# Altium schematic sheet [13] PWR1.SchDoc: Power supply
size A4; Engineer: M. Folejewski; DocumentNumber: 13; SheetNumber: 13; SheetTotal: 15; PageSize: A4; Designators: 900-949
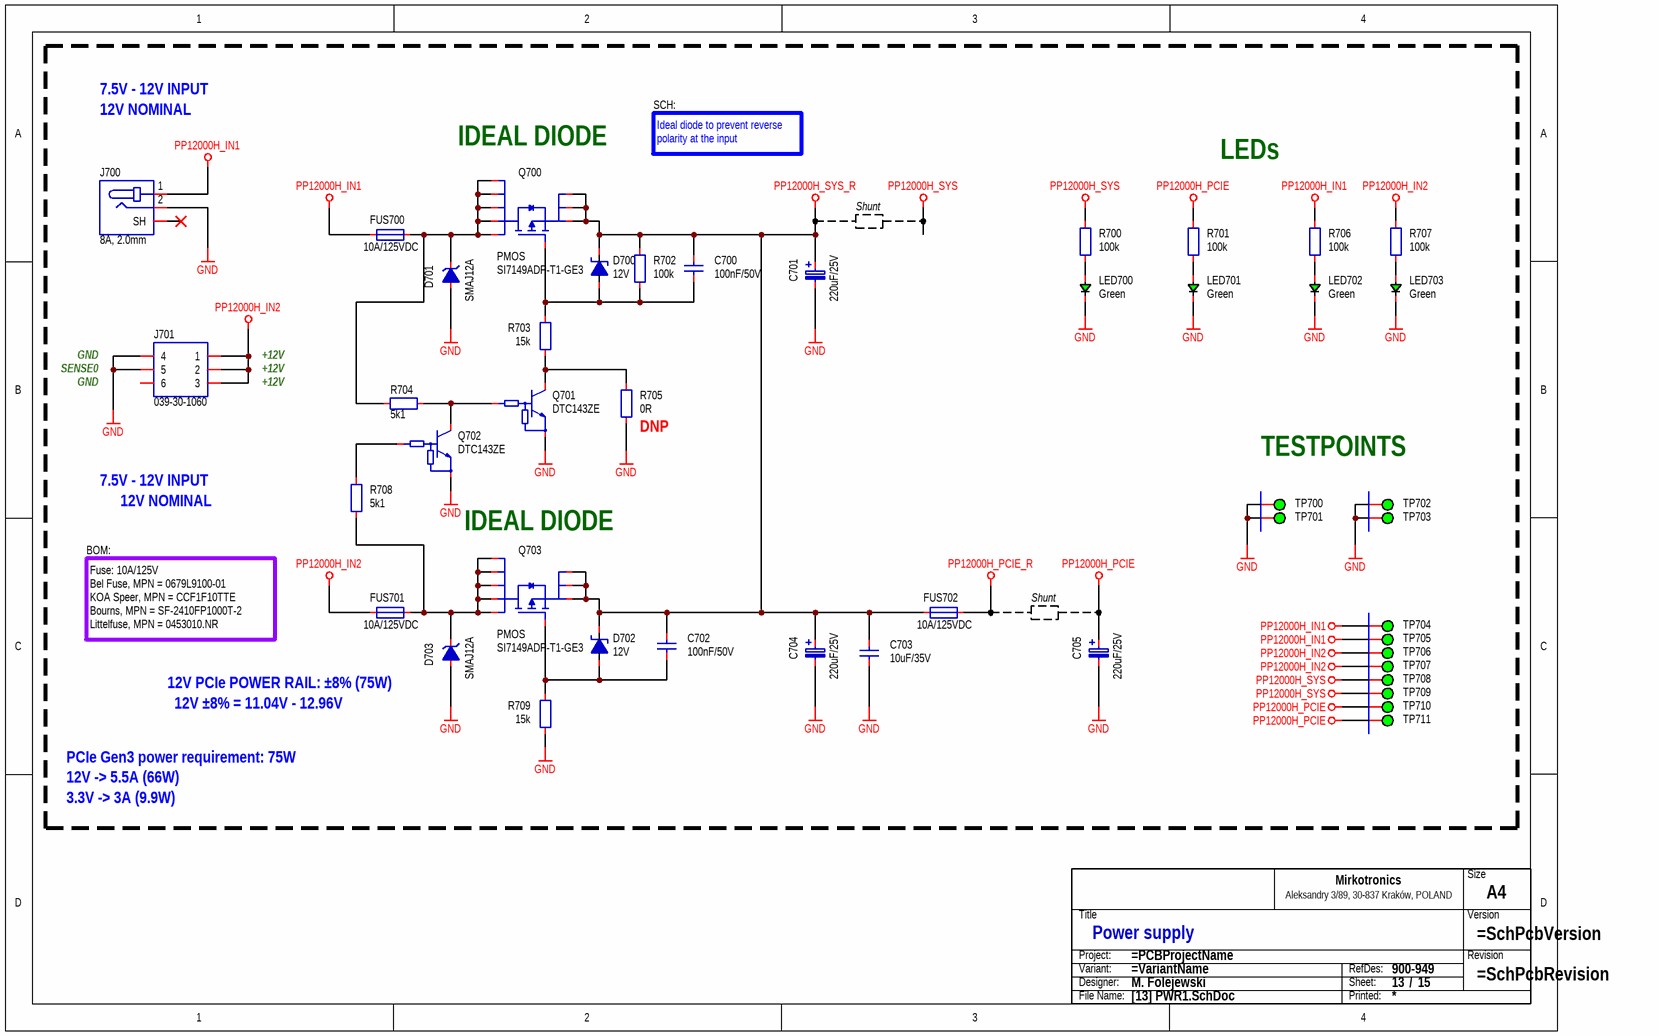
[diagram p0: [13] PWR1.SchDoc]

## Parts
C700  100nF/50V  [CAP_0603_R]
C701  220uF/25V  [CAP_SMD_SIZE_D8]
C702  100nF/50V  [CAP_0603_R]
C703  10uF/35V  [CAP_1206_R]
C704  220uF/25V  [CAP_SMD_SIZE_D8]
C705  220uF/25V  [CAP_SMD_SIZE_D8]
D700  12V  [PKG_SOT23-3_TO236]
D701  SMAJ12A  [DIO_SMA_UNI_R]
D702  12V  [PKG_SOT23-3_TO236]
D703  SMAJ12A  [DIO_SMA_UNI_R]
FUS700  10A/125VDC  [FUS_2410_R]
FUS701  10A/125VDC  [FUS_2410_R]
FUS702  10A/125VDC  [FUS_2410_R]
J700  8A, 2.0mm  [CON_CUI_PJ-063AH]
J701  039-30-1060  [CON_MLX_039301060]
LED700  Green  [LED_0805_GRN_R]
LED701  Green  [LED_0805_GRN_R]
LED702  Green  [LED_0805_GRN_R]
LED703  Green  [LED_0805_GRN_R]
Q700  PMOS  MPN: SI7149ADP-T1-GE3  [ICC_SO8_POWERPAK_490X590X112_P127_R]
Q701  DTC143ZE  [PKG_SOT523_SC75_SOT416_P100_R]
Q702  DTC143ZE  [PKG_SOT523_SC75_SOT416_P100_R]
Q703  PMOS  MPN: SI7149ADP-T1-GE3  [ICC_SO8_POWERPAK_490X590X112_P127_R]
R700  100k  [RES_0603_R]
R701  100k  [RES_0603_R]
R702  100k  [RES_0603_R]
R703  15k  [RES_0603_R]
R704  5k1  [RES_0603_R]
R705  0R  [RES_0603_R]
R706  100k  [RES_0603_R]
R707  100k  [RES_0603_R]
R708  5k1  [RES_0603_R]
R709  15k  [RES_0603_R]
TB?  Title block  (value not drawn)  (graphical)
TP700  ICT  [PCB_TP_ICT_100]  (value not drawn)  (no BOM)
TP701  ICT  [PCB_TP_ICT_100]  (value not drawn)  (no BOM)
TP702  ICT  [PCB_TP_ICT_100]  (value not drawn)  (no BOM)
TP703  ICT  [PCB_TP_ICT_100]  (value not drawn)  (no BOM)
TP704  ICT  [PCB_TP_ICT_100]  (value not drawn)  (no BOM)
TP705  ICT  [PCB_TP_ICT_100]  (value not drawn)  (no BOM)
TP706  ICT  [PCB_TP_ICT_100]  (value not drawn)  (no BOM)
TP707  ICT  [PCB_TP_ICT_100]  (value not drawn)  (no BOM)
TP708  ICT  [PCB_TP_ICT_100]  (value not drawn)  (no BOM)
TP709  ICT  [PCB_TP_ICT_100]  (value not drawn)  (no BOM)
TP710  ICT  [PCB_TP_ICT_100]  (value not drawn)  (no BOM)
TP711  ICT  [PCB_TP_ICT_100]  (value not drawn)  (no BOM)

## Nets
GND: C701.1 C703.1 C704.1 C705.1 D701.2(A) D703.2(A) J700.2 J701.4 J701.5 LED700.1 LED701.1 LED702.1 LED703.1 Q701.2(E) Q702.2(E) R705.1 R709.1 TP700.1 TP701.1 TP702.1 TP703.1
PP12000H_IN1: FUS700.1 J700.1 R706.2 TP704.1 TP705.1
PP12000H_IN2: FUS701.1 J701.1 J701.2 J701.3 R707.2 TP706.1 TP707.1
PP12000H_PCIE: C705.2 R701.2 TP710.1 TP711.1
PP12000H_PCIE_R: FUS702.2
PP12000H_SYS: R700.2 TP708.1 TP709.1
PP12000H_SYS_R: C700.2 C701.2 C702.2 C703.2 C704.2 D700.3(K) D702.3(K) FUS702.1 Q700.1(S) Q700.2(S) Q700.3(S) Q703.1(S) Q703.2(S) Q703.3(S) R702.2
NetC700_1: C700.1 D700.1(A) Q700.4(G) R702.1 R703.2
NetC702_1: C702.1 D702.1(A) Q703.4(G) R709.2
NetD701_1: D701.1(K) FUS700.2 Q700.5(D) Q700.6(D) Q700.7(D) Q700.8(D) Q700.EP(D) R704.1
NetD703_1: D703.1(K) FUS701.2 Q703.5(D) Q703.6(D) Q703.7(D) Q703.8(D) Q703.EP(D) R708.1
NetLED700_2: LED700.2 R700.1
NetLED701_2: LED701.2 R701.1
NetLED702_2: LED702.2 R706.1
NetLED703_2: LED703.2 R707.1
NetQ701_1: Q701.1(B) Q702.3(C) R704.2
NetQ701_3: Q701.3(C) R703.1 R705.2
NetQ702_1: Q702.1(B) R708.2

Not connected (* = marked no-connect by the designer): J700 SH*; J701 6

## Notes on the sheet
- 7.5V - 12V INPUT
- 12V NOMINAL
- SCH:
- (near Q700) IDEAL DIODE
- Ideal diode to prevent reverse polarity at the input
- LEDs
- Shunt
- GND
- SENSE0
- +12V
- (near R705) DNP
- TESTPOINTS
- BOM:
- (near Q703) IDEAL DIODE
- Fuse: 10A/125V
  Bel Fuse, MPN = 0679L9100-01
  KOA Speer, MPN = CCF1F10TTE
  Bourns, MPN = SF-2410FP1000T-2
  Littelfuse, MPN = 0453010.NR
- (near D703) 12V PCIe POWER RAIL: ±8% (75W)
- 12V ±8% = 11.04V - 12.96V
- PCIe Gen3 power requirement: 75W
- 12V -> 5.5A (66W)
- 3.3V -> 3A (9.9W)
- (in symbol SCH_TITLE_BLOCK_MIRKOTRONICS_V2) Size; Mirkotronics; Aleksandry 3/89, 30-837 Kraków, POLAND; Title; Version; Project:; Revision; Variant:; RefDes:; Designer:; Sheet:; /; File Name:; Printed:

## Library data of the parts
C700 C702 = CAP-0008: Capacitor; MLCC; 100nF; TBD; TBD; TBD; TBD; SMD; 0603 (1608);; Component Type: Capacitor; Component Subtype: MLCC; Value: 100nF/50V; Manufacturer: TBD; MPN: TBD; Mounting Type: SMD; Package (Case): 0603 (1608); Supplier: ?
C701 C704 C705 = CAP_POL_2P_NP: Capacitor; Polarized;; Manufacturer: Panasonic; MPN: EEEFTE221XAP; Component Subtype: Electrolytic; Package (Case): SMD SIZE D8; Component Type: Capacitor; Mounting Type: SMD; Value: 220uF/25V
C703 = CAP-0025: Capacitor; MLCC; GENERIC; TBD; TBD; TBD; TBD; SMD; 1206 (3216);; Component Type: Capacitor; Component Subtype: MLCC; Value: 10uF/35V; Manufacturer: GENERIC; MPN: GENERIC; Mounting Type: SMD; Package (Case): 1206 (3216); Supplier: ?
D700 D702 = DIO_ZEN_A_K: Diode; Zener;; MPN: MMBZ5242BLT3G; Manufacturer: ON Semi; Value: 12V
D701 D703 = DIO_TVS_UNI_KA: Diode; Schottky; Unipolar;; Manufacturer: Littelfuse; Component Subtype: TVS Diode; Value: SMAJ12A; MPN: SMAJ12A; Component Type: Diode; Mounting Type: SMD; Supplier: ?
FUS700-FUS702 = FUS: Fuse; Manufacturer: Bel Fuse; MPN: 0679L9100-01; Value: 10A/125VDC
J700 = CON_DC_A1_SH: Connector; DC Barrel Jack;; Manufacturer: CUI Devices; MPN: PJ-063AH; Package (Case): THT; Component Subtype: DC Barrel Jack; Component Type: Connector; Mounting Type: THT; Supplier 1: Mouser; Value: 8A, 2.0mm; Supplier Part Number 1: 490-PJ-063AH
J701 = CON_2X03_COL: Connector; 2 Row;; Manufacturer: Molex; Component Subtype: Wire to Board; Package (Case): THT; Component Type: Connector; Mounting Type: THT; MPN: 039-30-1060; Supplier 1: Mouser; Supplier Part Number 1: 538-39-30-1060; Value: 039-30-1060
LED700-LED703 = DIO_LED_GRN: Diode; LED; Green;; Manufacturer: Foshan NationStar Optoelectronics; MPN: NCD0805G1; Component Subtype: LED Diode; Package (Case): 0805 (2012); Value: Green; Component Type: LED; Mounting Type: SMD; Supplier: LCSC
Q700 Q703 = TRA_PMOS_SSSGDDDD_EP: Transistor; PMOS;; Manufacturer: Vishay; Component Subtype: P-MOSFET; Package (Case): PowerPAK-SO-8; Component Type: Transistor; Mounting Type: SMD; Supplier 1: Mouser; Supplier Part Number 1: 78-SI7149ADP-T1-GE3; Value: PMOS
Q701 Q702 = TRA_BJT_NPN_DIG_BEC: Transistor; BJT; NPN; Digital;; Component Subtype: NPN Transistor; Value: DTC143ZE; MPN: DTC143ZE; Component Type: Transistor; Mounting Type: SMD; Supplier: ?
R700-R702 R706 R707 = RES-0029: Resistor; Thick Film; 100k; 1%; 100mW; 100PPM; 75V; Standard; SMD; 0603 (1608);; Manufacturer: Yageo Corporation; MPN: TBD; Component Body: 1.60 x 0.80mm; Packaging Type: Tape & Reel; ID: RES-0029; Component Type: Resistor; Component Subtype: Thick Film; Value: 100k; Mounting Type: SMD; Package (Case): 0603 (1608); Component Height: 0.45mm; ROHS Status: RoHS Compliant; Operating Temperature: -55°C to +155°C; Resistance: 100k; Tolerance: 1%; Power Rating: 100mW; TCR: 100PPM; Voltage Rating: 75V; Features: Standard
R703 R709 = RES-0043: Resistor; Thick Film; 15k; 1%; 100mW; 100PPM; 75V; Standard; SMD; 0603 (1608);; Manufacturer: Yageo Corporation; MPN: TBD; Component Type: Resistor; Component Subtype: Thick Film; Value: 15k; Mounting Type: SMD; Package (Case): 0603 (1608); Supplier: ?
R704 R708 = RES-0043: Resistor; Thick Film; 5k1; 1%; 100mW; 100PPM; 75V; Standard; SMD; 0603 (1608);; Manufacturer: Yageo Corporation; MPN: TBD; Component Type: Resistor; Component Subtype: Thick Film; Value: 5k1; Mounting Type: SMD; Package (Case): 0603 (1608); Supplier: ?
R705 = RES-0052: Resistor; Thick Film; 0R; 1%; TBD; TBD; TBD; Standard; SMD; 0603 (1608);; Component Body: 1.60 x 0.80mm; ID: RES-0052; Component Type: Resistor; Component Subtype: Thick Film; Value: 0R; Manufacturer: TBD; MPN: TBD; Mounting Type: SMD; Package (Case): 0603 (1608); Component Height: 0.45mm; Packaging Type: TBD; ROHS Status: TBD; Operating Temperature: TBD; Resistance: 0R; Tolerance: 1%; Power Rating: TBD; TCR: TBD; Voltage Rating: TBD; Features: Standard
TB? = SCH_TITLE_BLOCK_MIRKOTRONICS_V2: Component Type: Title block; Manufacturer: -; Mounting Type: Non component; MPN: -; Operating Temperature: -; Package: -; Specification: Title block; Value: Title block; Replacement: -; System: ?
TP700-TP711 = PCB_TP_ICT: Test Point (ICT); Specification: Testpoint (for ICT), SMD pad; Component Type: Testpoint (for ICT); Manufacturer: -; Mounting Type: Non component; MPN: -; Value: ICT